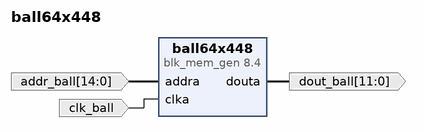
[diagram p0: block diagram of the top level]
# Vivado block design ball64x448, xc7a35tcpg236-1, Vivado 2023.2
create_bd_design ball64x448

create_bd_port -dir I -from 14 -to 0 addr_ball
create_bd_port -dir I -type clk clk_ball
create_bd_port -dir O -from 11 -to 0 dout_ball

create_bd_cell -type ip -vlnv xilinx.com:ip:blk_mem_gen:8.4 ball64x448
set_property -dict [list \
  CONFIG.Coe_File c:/Digital_Sys_Design/vga_sprites/vga_sprites.documents/ball.coe \
  CONFIG.Enable_A Always_Enabled \
  CONFIG.Load_Init_File true \
  CONFIG.Memory_Type Single_Port_ROM \
  CONFIG.Write_Depth_A 28672 \
  CONFIG.Write_Width_A 12 \
  CONFIG.use_bram_block Stand_Alone \
] [get_bd_cells ball64x448]

# ---- connections ----

connect_bd_net -net addra_0_1 [get_bd_ports addr_ball] [get_bd_pins ball64x448/addra]
connect_bd_net [get_bd_pins ball64x448/douta] [get_bd_ports dout_ball]
connect_bd_net -net clka_0_1 [get_bd_ports clk_ball] [get_bd_pins ball64x448/clka]

validate_bd_design
save_bd_design
